# Altium schematic sheet A7_FUNCTION1.SchDoc
size A3
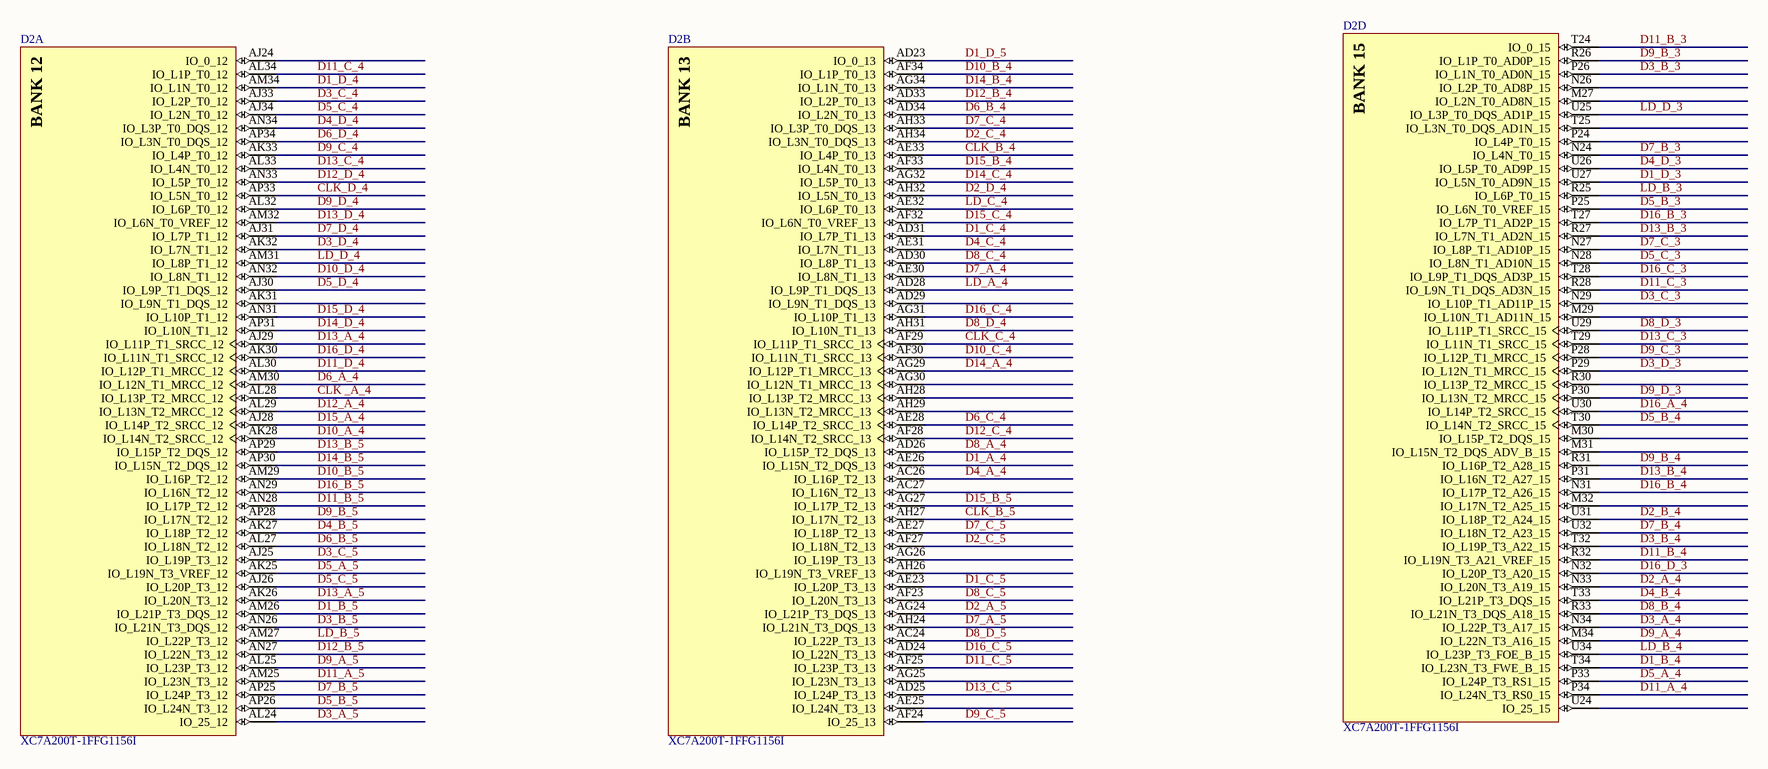
[diagram p0: A7_FUNCTION1.SchDoc]

## Parts
D2  XC7A200T-1FFG1156I  [FFG1156]  (parts A,B,D of 18)

## Nets
CLK _A_4: D2.AL28(IO_L13P_T2_MRCC_12)
CLK_B_4: D2.AE33(IO_L4P_T0_13)
CLK_B_5: D2.AH27(IO_L17N_T2_13)
CLK_C_4: D2.AF29(IO_L11P_T1_SRCC_13)
CLK_D_4: D2.AP33(IO_L5N_T0_12)
D1_A_4: D2.AE26(IO_L15N_T2_DQS_13)
D1_B_4: D2.T34(IO_L23N_T3_FWE_B_15)
D1_B_5: D2.AM26(IO_L21P_T3_DQS_12)
D1_C_4: D2.AD31(IO_L7P_T1_13)
D1_C_5: D2.AE23(IO_L20P_T3_13)
D1_D_3: D2.U27(IO_L5N_T0_AD9N_15)
D1_D_4: D2.AM34(IO_L1N_T0_12)
D1_D_5: D2.AD23(IO_0_13)
D2_A_4: D2.N33(IO_L20N_T3_A19_15)
D2_A_5: D2.AG24(IO_L21P_T3_DQS_13)
D2_B_4: D2.U31(IO_L18P_T2_A24_15)
D2_C_4: D2.AH34(IO_L3N_T0_DQS_13)
D2_C_5: D2.AF27(IO_L18N_T2_13)
D2_D_4: D2.AH32(IO_L5N_T0_13)
D3_A_4: D2.N34(IO_L22P_T3_A17_15)
D3_A_5: D2.AL24(IO_25_12)
D3_B_3: D2.P26(IO_L1N_T0_AD0N_15)
D3_B_4: D2.T32(IO_L19P_T3_A22_15)
D3_B_5: D2.AN26(IO_L21N_T3_DQS_12)
D3_C_3: D2.N29(IO_L10P_T1_AD11P_15)
D3_C_4: D2.AJ33(IO_L2P_T0_12)
D3_C_5: D2.AJ25(IO_L19P_T3_12)
D3_D_3: D2.P29(IO_L12N_T1_MRCC_15)
D3_D_4: D2.AK32(IO_L7N_T1_12)
D4_A_4: D2.AC26(IO_L16P_T2_13)
D4_B_4: D2.T33(IO_L21P_T3_DQS_15)
D4_B_5: D2.AK27(IO_L18P_T2_12)
D4_C_4: D2.AE31(IO_L7N_T1_13)
D4_D_3: D2.U26(IO_L5P_T0_AD9P_15)
D4_D_4: D2.AN34(IO_L3P_T0_DQS_12)
D5_A_4: D2.P33(IO_L24P_T3_RS1_15)
D5_A_5: D2.AK25(IO_L19N_T3_VREF_12)
D5_B_3: D2.P25(IO_L6N_T0_VREF_15)
D5_B_4: D2.T30(IO_L14N_T2_SRCC_15)
D5_B_5: D2.AP26(IO_L24N_T3_12)
D5_C_3: D2.N28(IO_L8N_T1_AD10N_15)
D5_C_4: D2.AJ34(IO_L2N_T0_12)
D5_C_5: D2.AJ26(IO_L20P_T3_12)
D5_D_4: D2.AJ30(IO_L9P_T1_DQS_12)
D6_A_4: D2.AM30(IO_L12N_T1_MRCC_12)
D6_B_4: D2.AD34(IO_L2N_T0_13)
D6_B_5: D2.AL27(IO_L18N_T2_12)
D6_C_4: D2.AE28(IO_L14P_T2_SRCC_13)
D6_D_4: D2.AP34(IO_L3N_T0_DQS_12)
D7_A_4: D2.AE30(IO_L8N_T1_13)
D7_A_5: D2.AH24(IO_L21N_T3_DQS_13)
D7_B_3: D2.N24(IO_L4N_T0_15)
D7_B_4: D2.U32(IO_L18N_T2_A23_15)
D7_B_5: D2.AP25(IO_L24P_T3_12)
D7_C_3: D2.N27(IO_L8P_T1_AD10P_15)
D7_C_4: D2.AH33(IO_L3P_T0_DQS_13)
D7_C_5: D2.AE27(IO_L18P_T2_13)
D7_D_4: D2.AJ31(IO_L7P_T1_12)
D8_A_4: D2.AD26(IO_L15P_T2_DQS_13)
D8_B_4: D2.R33(IO_L21N_T3_DQS_A18_15)
D8_C_4: D2.AD30(IO_L8P_T1_13)
D8_C_5: D2.AF23(IO_L20N_T3_13)
D8_D_3: D2.U29(IO_L11P_T1_SRCC_15)
D8_D_4: D2.AH31(IO_L10N_T1_13)
D8_D_5: D2.AC24(IO_L22P_T3_13)
D9_A_4: D2.M34(IO_L22N_T3_A16_15)
D9_A_5: D2.AL25(IO_L23P_T3_12)
D9_B_3: D2.R26(IO_L1P_T0_AD0P_15)
D9_B_4: D2.R31(IO_L16P_T2_A28_15)
D9_B_5: D2.AP28(IO_L17N_T2_12)
D9_C_3: D2.P28(IO_L12P_T1_MRCC_15)
D9_C_4: D2.AK33(IO_L4P_T0_12)
D9_C_5: D2.AF24(IO_25_13)
D9_D_3: D2.P30(IO_L13N_T2_MRCC_15)
D9_D_4: D2.AL32(IO_L6P_T0_12)
D10_A_4: D2.AK28(IO_L14N_T2_SRCC_12)
D10_B_4: D2.AF34(IO_L1P_T0_13)
D10_B_5: D2.AM29(IO_L16P_T2_12)
D10_C_4: D2.AF30(IO_L11N_T1_SRCC_13)
D10_D_4: D2.AN32(IO_L8N_T1_12)
D11_A_4: D2.P34(IO_L24N_T3_RS0_15)
D11_A_5: D2.AM25(IO_L23N_T3_12)
D11_B_3: D2.T24(IO_0_15)
D11_B_4: D2.R32(IO_L19N_T3_A21_VREF_15)
D11_B_5: D2.AN28(IO_L17P_T2_12)
D11_C_3: D2.R28(IO_L9N_T1_DQS_AD3N_15)
D11_C_4: D2.AL34(IO_L1P_T0_12)
D11_C_5: D2.AF25(IO_L23P_T3_13)
D11_D_4: D2.AL30(IO_L12P_T1_MRCC_12)
D12_A_4: D2.AL29(IO_L13N_T2_MRCC_12)
D12_B_4: D2.AD33(IO_L2P_T0_13)
D12_B_5: D2.AN27(IO_L22N_T3_12)
D12_C_4: D2.AF28(IO_L14N_T2_SRCC_13)
D12_D_4: D2.AN33(IO_L5P_T0_12)
D13_A_4: D2.AJ29(IO_L11P_T1_SRCC_12)
D13_A_5: D2.AK26(IO_L20N_T3_12)
D13_B_3: D2.R27(IO_L7N_T1_AD2N_15)
D13_B_4: D2.P31(IO_L16N_T2_A27_15)
D13_B_5: D2.AP29(IO_L15P_T2_DQS_12)
D13_C_3: D2.T29(IO_L11N_T1_SRCC_15)
D13_C_4: D2.AL33(IO_L4N_T0_12)
D13_C_5: D2.AD25(IO_L24P_T3_13)
D13_D_4: D2.AM32(IO_L6N_T0_VREF_12)
D14_A_4: D2.AG29(IO_L12P_T1_MRCC_13)
D14_B_4: D2.AG34(IO_L1N_T0_13)
D14_B_5: D2.AP30(IO_L15N_T2_DQS_12)
D14_C_4: D2.AG32(IO_L5P_T0_13)
D14_D_4: D2.AP31(IO_L10N_T1_12)
D15_A_4: D2.AJ28(IO_L14P_T2_SRCC_12)
D15_B_4: D2.AF33(IO_L4N_T0_13)
D15_B_5: D2.AG27(IO_L17P_T2_13)
D15_C_4: D2.AF32(IO_L6N_T0_VREF_13)
D15_D_4: D2.AN31(IO_L10P_T1_12)
D16_A_4: D2.U30(IO_L14P_T2_SRCC_15)
D16_B_3: D2.T27(IO_L7P_T1_AD2P_15)
D16_B_4: D2.N31(IO_L17P_T2_A26_15)
D16_B_5: D2.AN29(IO_L16N_T2_12)
D16_C_3: D2.T28(IO_L9P_T1_DQS_AD3P_15)
D16_C_4: D2.AG31(IO_L10P_T1_13)
D16_C_5: D2.AD24(IO_L22N_T3_13)
D16_D_3: D2.N32(IO_L20P_T3_A20_15)
D16_D_4: D2.AK30(IO_L11N_T1_SRCC_12)
LD_A_4: D2.AD28(IO_L9P_T1_DQS_13)
LD_B_3: D2.R25(IO_L6P_T0_15)
LD_B_4: D2.U34(IO_L23P_T3_FOE_B_15)
LD_B_5: D2.AM27(IO_L22P_T3_12)
LD_C_4: D2.AE32(IO_L6P_T0_13)
LD_D_3: D2.U25(IO_L3P_T0_DQS_AD1P_15)
LD_D_4: D2.AM31(IO_L8P_T1_12)

Not connected (* = marked no-connect by the designer): D2 AC27(IO_L16N_T2_13) AD29(IO_L9N_T1_DQS_13) AE25(IO_L24N_T3_13) AG25(IO_L23N_T3_13) AG26(IO_L19P_T3_13) AG30(IO_L12N_T1_MRCC_13) AH26(IO_L19N_T3_VREF_13) AH28(IO_L13P_T2_MRCC_13) AH29(IO_L13N_T2_MRCC_13) AJ24(IO_0_12) AK31(IO_L9N_T1_DQS_12) M27(IO_L2N_T0_AD8N_15) M29(IO_L10N_T1_AD11N_15) M30(IO_L15P_T2_DQS_15) M31(IO_L15N_T2_DQS_ADV_B_15) M32(IO_L17N_T2_A25_15) N26(IO_L2P_T0_AD8P_15) P24(IO_L4P_T0_15) R30(IO_L13P_T2_MRCC_15) T25(IO_L3N_T0_DQS_AD1N_15) U24(IO_25_15)

## Notes on the sheet
- (in symbol XC7A200T-1FFG1156I, part A) BANK 12
- (in symbol XC7A200T-1FFG1156I, part B) BANK 13
- (in symbol XC7A200T-1FFG1156I, part D) BANK 15

## Library data of the parts
D2 = XC7A200T-1FFG1156I: Artix-7 FPGA, 500 User I/Os, 16 GTP, 1156-Ball BGA, Speed Grade 1, Industrial Grade, Pb-Free; Manufacturer: Xilinx; Block RAM Blocks (18Kb): 730; Block RAM Blocks (36Kb): 365; Block RAM Blocks (Max Kb): 13140; CLBs (Slices): 33650; Clock Mgmt Tiles (CMTs): 10; DSP48E1 Slices: 740; Logic Cells: 215360; Max User I/O: 500; Speed Grade: -1; DatasheetVersion: v1.12; PackageVersion: Rev 1.8; PackageReference: FFG1156; PackageDescription: Flip-Chip BGA, Body 35 x 35 mm, 1.0 mm Pitch; CLBs (Max Distributed RAM Kb): 2888; Generic Part Number: XC7A200T; RoHS: Pb-Free; Mounting Technology: Surface Mount; Code_JEDEC: MS-034-AAR-1; PartNumber: XC7A200T-1FFG1156I; ComponentLink1Description: Datasheet; ComponentLink1URL: http://www.xilinx.com/support/documentation/data_sheets/ds180_7Series_Overview.pdf; ComponentLink2Description: Package Specification; ComponentLink2URL: http://www.xilinx.com/support/documentation/user_guides/ug475_7Series_Pkg_Pinout.pdf; ComponentLink3Description: DC and Switching Characteristics; ComponentLink3URL: http://www.xilinx.com/support/documentation/data_sheets/ds181_Artix_7_Data_Sheet.pdf; ComponentLink4Description: Package File; ComponentLink4URL: http://www.xilinx.com/support/packagefiles/a7packages/xc7a200tfbg676pkg.txt; ComponentLink5Description: Packaging and Pinout; ComponentLink5URL: http://www.xilinx.com/support/documentation/user_guides/ug475_7Series_Pkg_Pinout.pdf